# EAGLE design RyanTest1 (EAGLE 7.3.0)
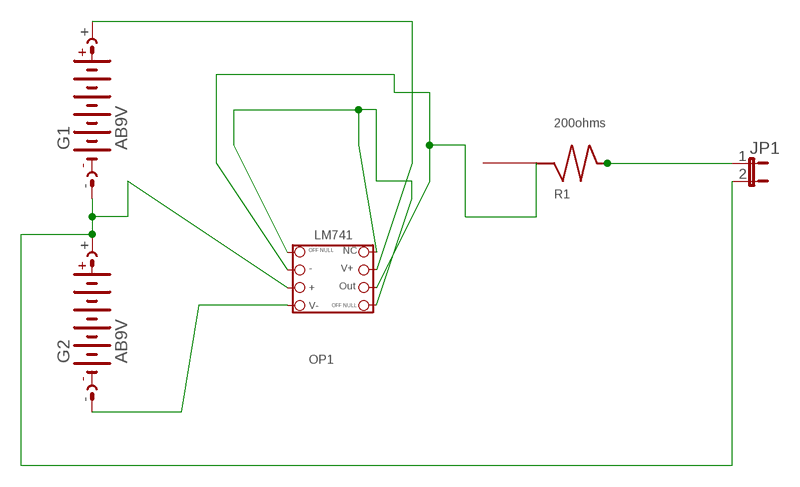
[diagram p0: schematic, sheet 1]

## Parts
G1  AB9V  [AB9V]
G2  AB9V  [AB9V]
JP1  JP1E  [JP1]
OP1  OPAMP1  [OPAMP1]
R1  200ohms  R-10  [R-10]

## Nets
9V: G1.+ OP1.6
GND: G1.- G2.+ JP1.2 OP1.3
N$1: JP1.1 R1.4
N$2: OP1.1 OP1.5 OP1.8
N$4: G2.- OP1.4
N$6: OP1.2 OP1.7 R1.3

## Library data of the parts
G1 G2 = battery:AB9V: 9-V BATTERY CLIP
JP1 = jumper:JP1E: JUMPER
OP1 = TestLibrary:OPAMP1
R1 = TestLibrary:R-10

## Board
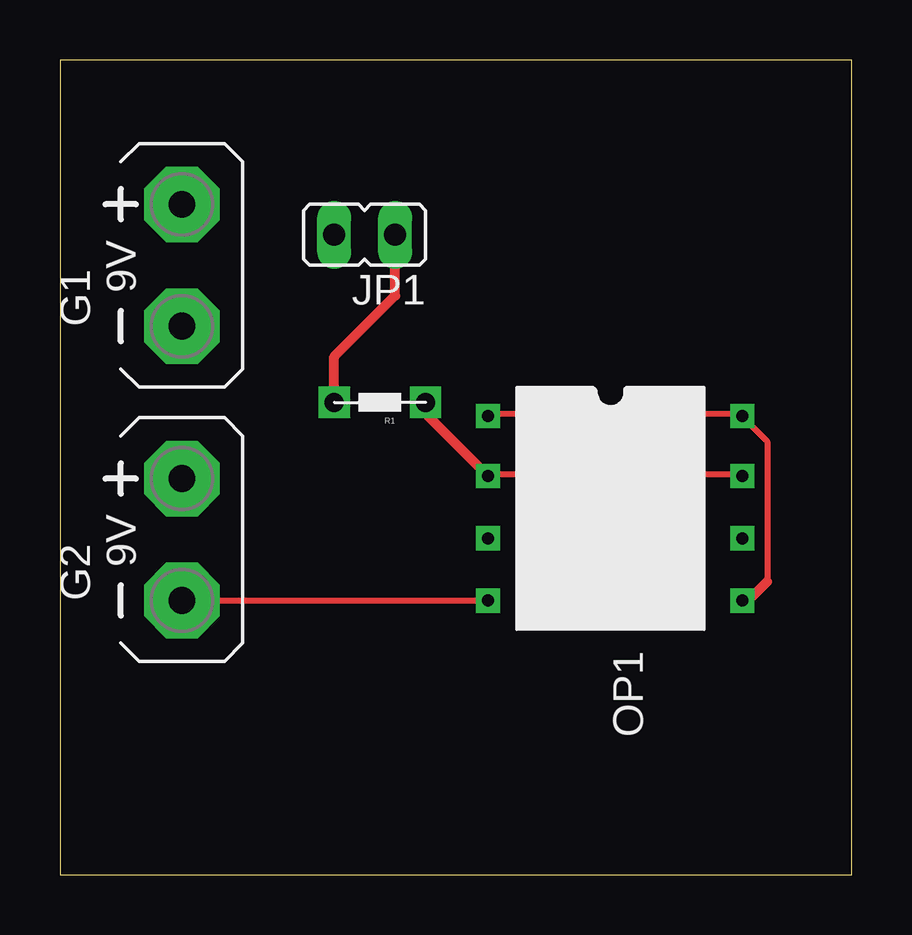
[diagram p1: board, top side]
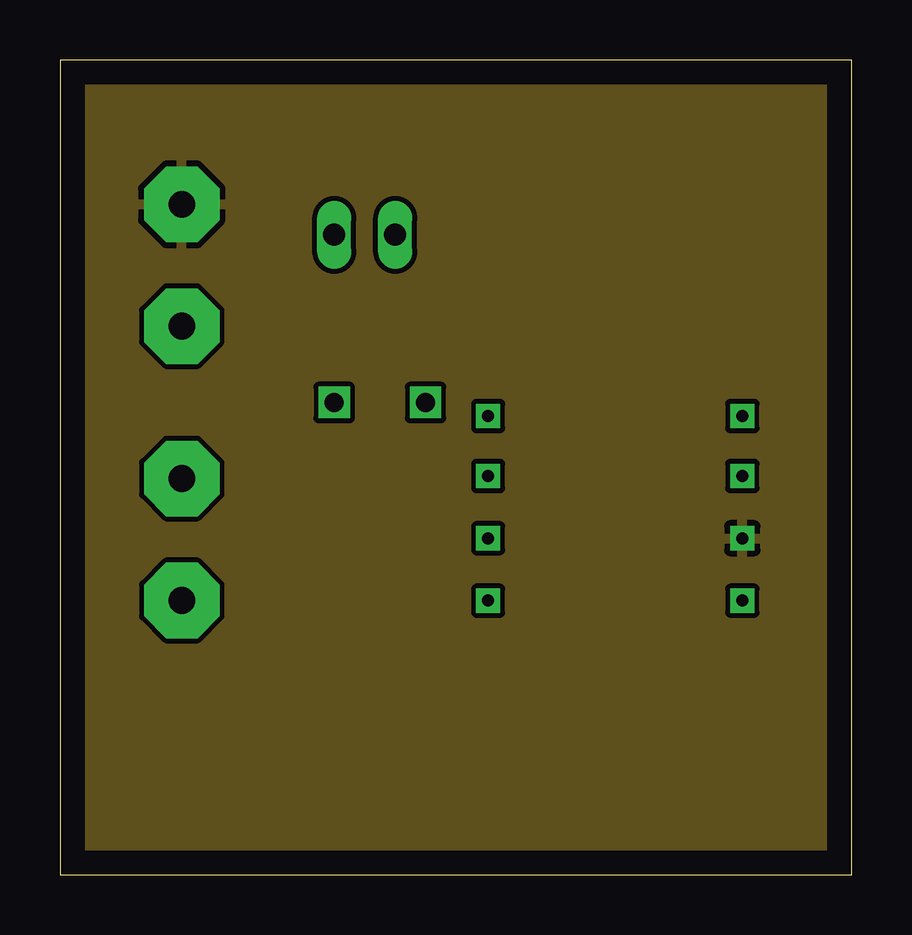
[diagram p2: board, inner layer Route5]
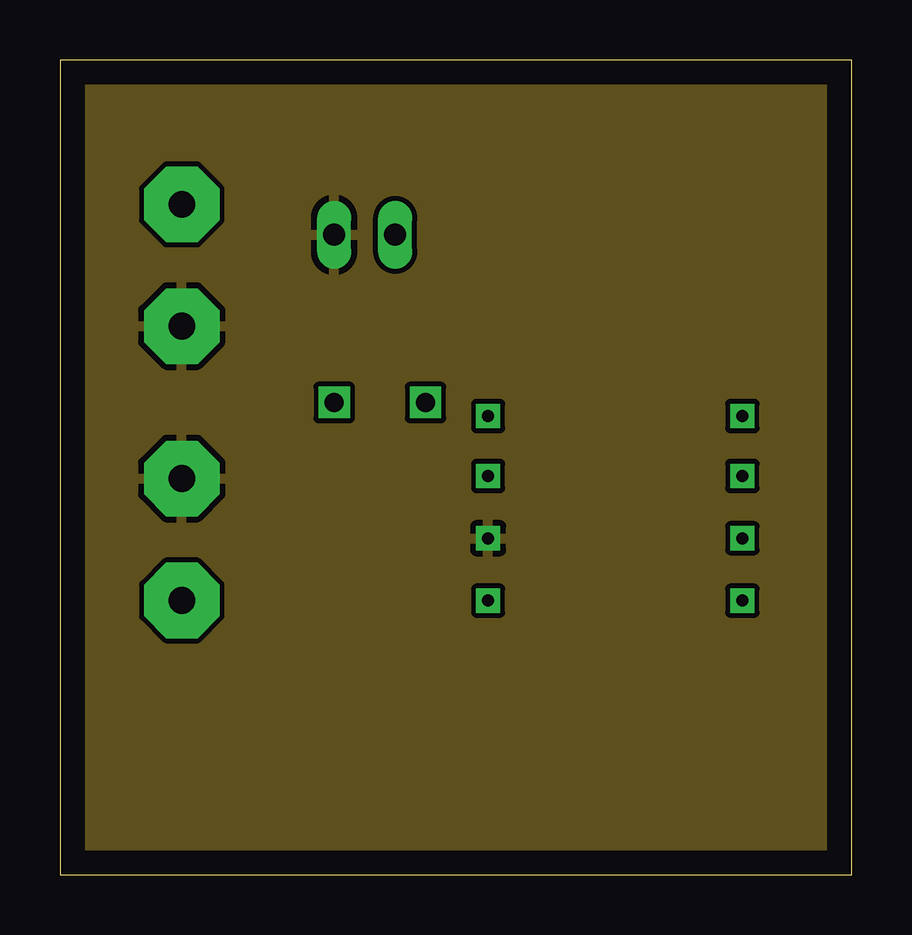
[diagram p3: board, inner layer Route8]

Size 33 x 33.96 mm. Coordinates in mm from the lower left corner, seen from the top.
Outline: 0,0 33,0 33,33.96 0,33.96 0,0
Copper layers (1*5*8*16): Top 0.035mm / dielectric 0.5mm / Route5 0.035mm / dielectric 0.5mm / Route8 0.035mm / dielectric 0.5mm / Bottom 0.035mm
Design rules "default *": minimum track width 10mil, minimum drill 24mil, track to track 8mil, track to pad 8mil, pad to pad 8mil, via to via 8mil, smd to smd 8mil, copper to edge 40mil, drill to drill 8mil, minimum pad ring 10mil, minimum via ring 8mil, stop-mask expansion 4mil, vias tented up to drill 0mil, thermal gap 10mil

### Footprints (pad centres in the part's own frame; a part is rotated, then mirrored left to right if it is on the bottom)
AB9V = drill 1.118 pad 3.15 octagon: + 0,2.54; - 0,-2.54
JP1 = drill 0.914 long: 1 0,-1.27; 2 0,1.27
OPAMP1 = drill 0.5 pad 0.813 square: 1 1.2,-1.2; 2 3.7,-1.2; 3 6.3,-1.2; 4 8.9,-1.2; 5 8.9,9.4; 6 6.3,9.4; 7 3.7,9.4; 8 1.2,9.4
R-10 = drill 0.8 square: 3 0,0.635; 4 3.81,0.635

### Placement (x,y rotation side)
G1  5.08,25.4 0 top
G2  5.08,13.97 0 top
JP1  12.7,26.67 90 top
OP1  19.05,20.32 270 top
R1  15.24,20.32 180 top

### Tracks (layer width: path | path; a pad name or v marks a point on that pad's centre or on a via)
9V
  pour Route5: -2.54,35.56 -2.54,-1.27 34.29,-1.27 34.29,35.56
GND
  pour Route8: -2.54,35.56 -2.54,-1.27 34.29,-1.27 34.29,35.56
N$1
  Top 0.406: R1.4 11.43,21.59 13.97,24.13 JP1.1
N$2
  Top 0.254: 28.57,11.3 28.57,11.43 OP1.5 | 29.49,12.22 29.49,18.06 28.57,18.97 OP1.8 28.35,19.2 18.06,19.2 OP1.1
  Top 0.406: 28.57,11.3 29.49,12.22
N$4
  Top 0.254: G2.- 17.83,11.43 OP1.4
N$6
  Top 0.254: OP1.2 18.06,16.69 28.35,16.69 OP1.7
  Top 0.406: OP1.2 15.24,19.23 R1.3